# EAGLE schematic microbean (EAGLE 7.7.0)
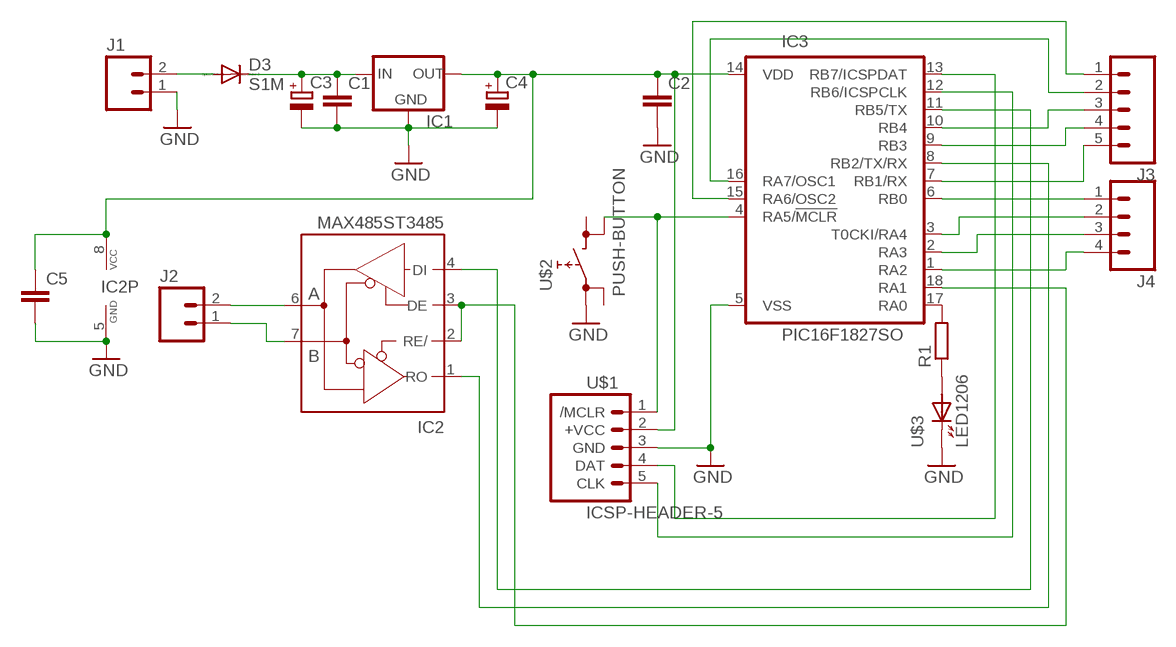
[diagram p0: schematic, sheet 1]

## Parts
C1  C-EUC0805  [C0805]
C2  C-EUC0805  [C0805]
C3  CPOL-EUSMD4X5.3  [UD-4X5,8_NICHICON]
C4  CPOL-EUSMD4X5.3  [UD-4X5,8_NICHICON]
C5  C-EUC0805  [C0805]
D3  S1M  [SMA]
IC1  78LXXSOT89  [SOT89]
IC2  MAX485ST3485  [SO08]
IC3  PIC16F1827SO  [SO-18W]
J1  M02-SCREW-3.5MM3.5MM  [SCREWTERMINAL-3.5MM-2]
J2  M02-SCREW-3.5MM3.5MM  [SCREWTERMINAL-3.5MM-2]
J3  M05PTH  [1X05]
J4  M04  [1X04]
R1  R-EU_R0805  [R0805]
U$1  ICSP-HEADER-5  [1X05]
U$2  PUSH-BUTTON  [MICRO-SWITCH]
U$3  LED1206  [CHIPLED_1206]

## Nets
GND: C1.2 C2.2 C3.- C4.- C5.2 IC1.2(GND) IC2.5(GND) IC3.5(VSS) J1.1 U$1.3(GND) U$2.1 U$3.C(K)
N$1: D3.A J1.2
N$2: C1.1 C3.+ D3.C IC1.3(IN)
N$3: IC2.7(B) J2.1
N$4: IC3.16(RA7/OSC1) J3.2
N$5: IC2.6(A) J2.2
N$6: IC3.4(RA5/!MCLR) U$1.1(/MCLR) U$2.4
N$7: IC3.13(RB7/ICSPDAT) U$1.4(DAT)
N$8: IC3.12(RB6/ICSPCLK) U$1.5(CLK)
N$9: IC3.17(RA0) R1.2
N$10: R1.1 U$3.A
N$11: IC2.4(DI) IC3.11(RB5/TX)
N$12: IC2.1(RO) IC3.8(RB2/TX/RX)
N$13: C2.1 C4.+ C5.1 IC1.1(OUT) IC2.8(VCC) IC3.14(VDD) U$1.2(+VCC)
N$14: IC3.1(RA2) J4.4
N$15: IC3.2(RA3) J4.3
N$16: IC3.3(T0CKI/RA4) J4.2
N$17: IC3.6(RB0) J4.1
N$18: IC3.7(RB1/RX) J3.5
N$19: IC3.9(RB3) J3.4
N$20: IC3.10(RB4) J3.3
N$21: IC3.15(RA6/OSC2) J3.1
N$23: IC2.2(RE/) IC2.3(DE) IC3.18(RA1)
Unconnected: U$2.2 U$2.3

## Library data of the parts
C1 C2 C5 = custom:C-EU: CAPACITOR, European symbol
C3 C4 = custom:CPOL-EU: POLARIZED CAPACITOR, European symbol
D3 = diode:S1M
IC1 = custom:78LXX: VOLTAGE REGULATOR
IC2 = custom:MAX485: RS485 TRANSEIVER
IC3 = custom:PIC16F1827: MICROCONTROLLER
J1 J2 = custom:M02-SCREW-3.5MM: Standard 2-pin 0.1" header. Use with - straight break away headers ( PRT-00116) - right angle break away headers (PRT-00553) - swiss pins (PRT-00743) - machine pins (PRT-00117) - female headers (PRT-00115) Molex polarized connector foot print use with: PRT-08233 with associated crimp pins and housings. 2.54_SCREWTERM for use with PRT-10571. 3.5mm Screw Terminal footprints for PRT-08084 5mm Screw Terminal footprints for use with PRT-08432; PROD_ID: CONN-08399
J3 = custom:M05
J4 = custom:M04
R1 = custom:R-EU_: RESISTOR, European symbol
U$1 = custom:ICSP-HEADER-5
U$2 = custom:PUSH-BUTTON
U$3 = custom:LED